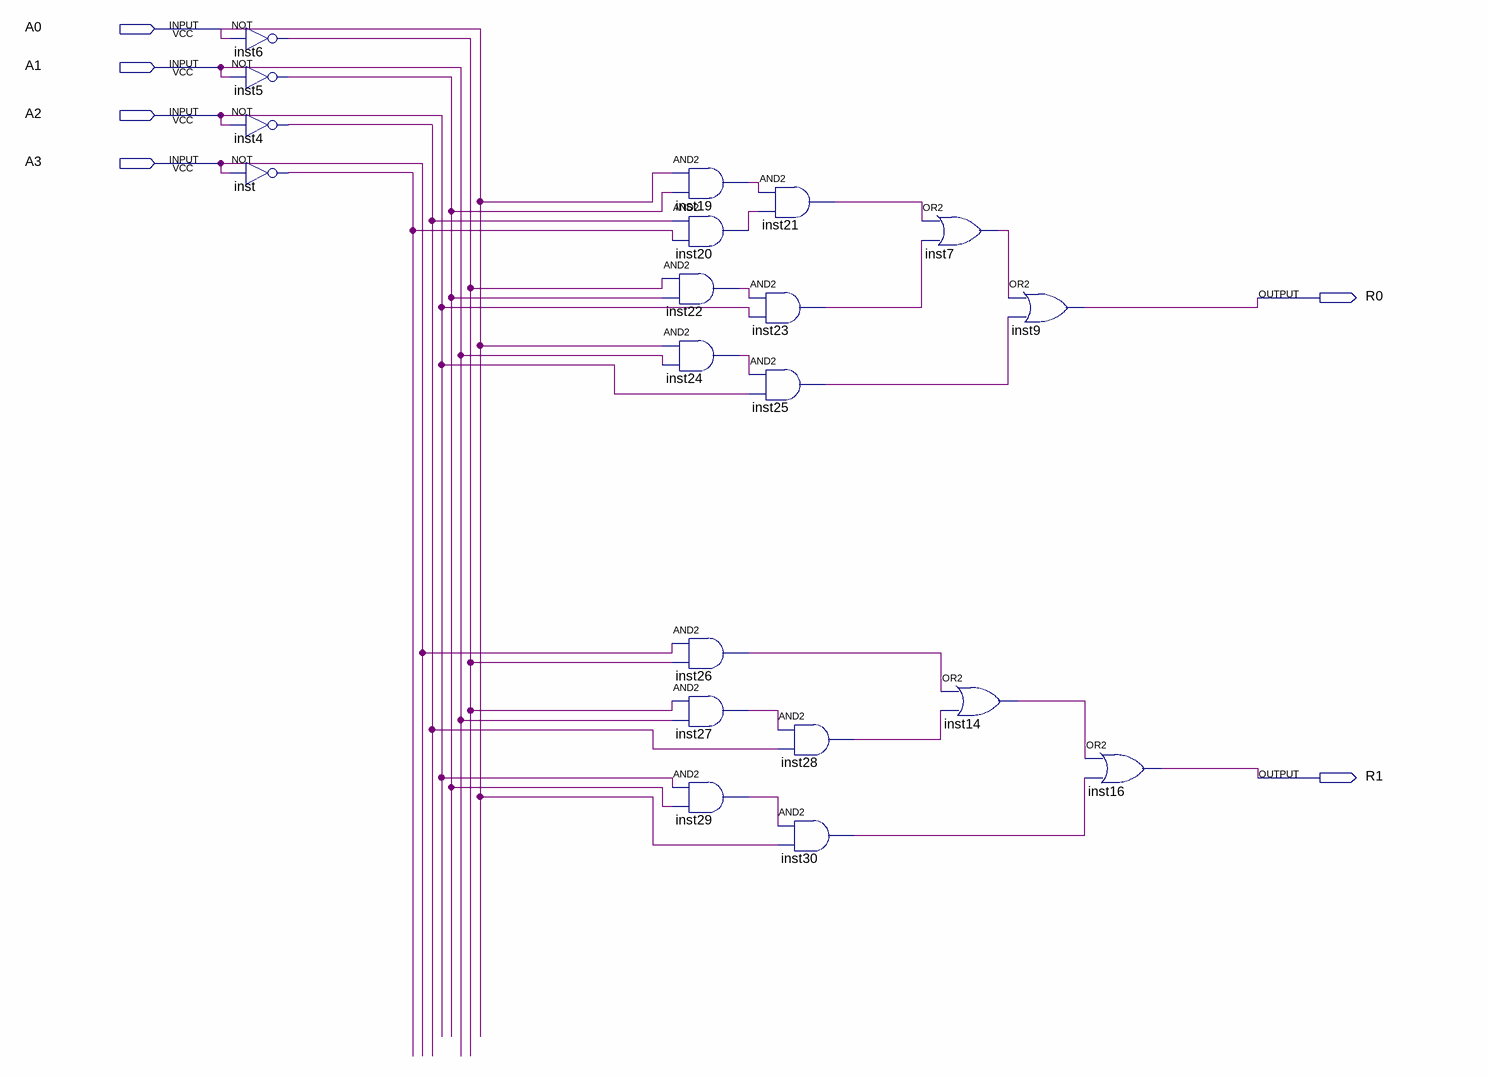
[diagram p0: schematic sheet]
// Quartus schematic MOD_3.bdf as structural Verilog: 20 symbols, 6 pins
module MOD_3 (
  input  A0,
  input  A1,
  input  A2,
  input  A3,
  output R0,
  output R1
);

  wire inst4_out, inst5_out, inst6_out, inst7_out, inst14_out, inst19_out, inst20_out, inst21_out,
       inst22_out, inst23_out, inst24_out, inst25_out, inst26_out, inst27_out, inst28_out, inst29_out,
       inst30_out, inst_out;

  not inst6 (inst6_out, A0);
  not inst5 (inst5_out, A1);
  not inst4 (inst4_out, A2);
  not inst (inst_out, A3);
  and inst19 (inst19_out, A0, inst5_out);
  and inst20 (inst20_out, inst4_out, inst_out);
  and inst22 (inst22_out, inst6_out, inst5_out);
  and inst24 (inst24_out, A0, A1);
  and inst26 (inst26_out, A3, inst6_out);
  and inst27 (inst27_out, inst6_out, A1);
  and inst29 (inst29_out, A2, inst5_out);
  and inst21 (inst21_out, inst19_out, inst20_out);
  and inst23 (inst23_out, inst22_out, A2);
  and inst25 (inst25_out, inst24_out, A2);
  and inst28 (inst28_out, inst27_out, inst4_out);
  and inst30 (inst30_out, inst29_out, A0);
  or inst7 (inst7_out, inst21_out, inst23_out);
  or inst14 (inst14_out, inst26_out, inst28_out);
  or inst9 (R0, inst7_out, inst25_out);
  or inst16 (R1, inst14_out, inst30_out);
endmodule
